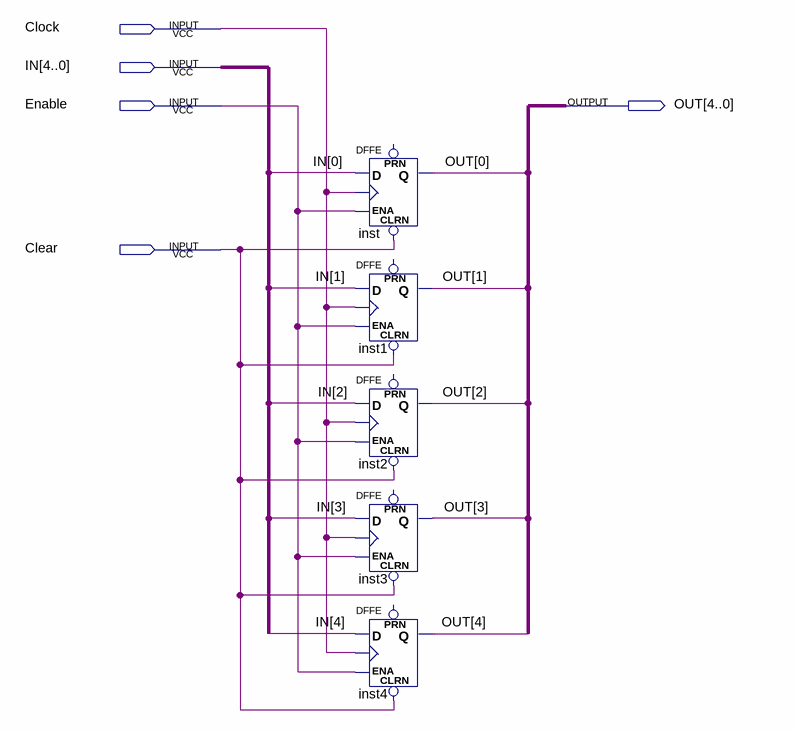
[diagram p0: schematic sheet]
// Quartus schematic registrador5.bdf as structural Verilog: 5 symbols, 5 pins
module registrador5 (
  input  Clock,
  input  [4:0] IN,
  input  Enable,
  input  Clear,
  output [4:0] OUT
);

  DFFE inst (.CLRN(Clear), .D(IN[0]), .CLK(Clock), .ENA(Enable), .Q(OUT[0]));  // open: PRN
  DFFE inst1 (.CLRN(Clear), .D(IN[1]), .CLK(Clock), .ENA(Enable), .Q(OUT[1]));  // open: PRN
  DFFE inst2 (.CLRN(Clear), .D(IN[2]), .CLK(Clock), .ENA(Enable), .Q(OUT[2]));  // open: PRN
  DFFE inst3 (.CLRN(Clear), .D(IN[3]), .CLK(Clock), .ENA(Enable), .Q(OUT[3]));  // open: PRN
  DFFE inst4 (.CLRN(Clear), .D(IN[4]), .CLK(Clock), .ENA(Enable), .Q(OUT[4]));  // open: PRN
endmodule
